# Altium schematic sheet 1S锂电池充电_tp4054.SchDoc
size A4; SheetNumber: 6; SheetTotal: 7
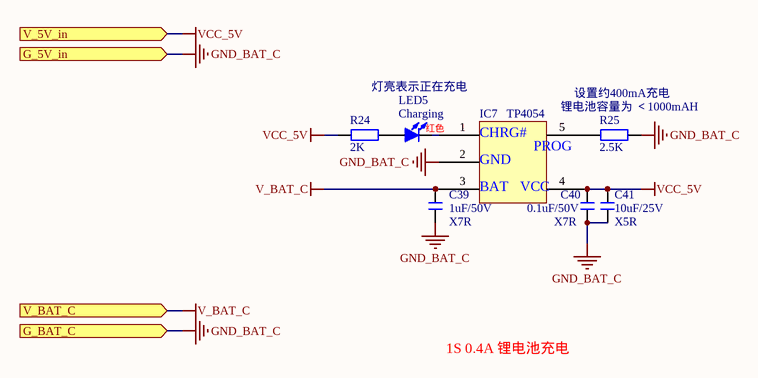
[diagram p0: 1S锂电池充电_tp4054.SchDoc]

## Parts
C39  1uF/50V  BOM名称: X7R  [C 0603_L]
C40  0.1uF/50V  BOM名称: X7R  [C 0402_L]
C41  10uF/25V  BOM名称: X5R  [C 0603_L]
IC7  TP4054  [SOT23-5N]
LED5  Charging  [LED 0805R]
R24  2K  [R 0402_L]
R25  2.5K  [R 0402_L]

## Ports
G_5V_in (in), G_BAT_C (in), V_5V_in (in), V_BAT_C (in)

## Nets
GND_BAT_C: C39.1 C40.2 C41.1 IC7.2 R25.2 ; port G_5V_in, port G_BAT_C
V_BAT_C: C39.2 IC7.3 ; port V_BAT_C
VCC_5V: C40.1 C41.2 IC7.4 R24.2 ; port V_5V_in
NetIC7_1: IC7.1 LED5.2(K)
NetIC7_5: IC7.5 R25.1
NetLED5_1: LED5.1(A) R24.1

## Notes on the sheet
- 灯亮表示正在充电
- 锂电池容量为 ＜1000mAH
- 设置约400mA充电
- (near LED5) 红色
- (near IC7) CHRG#
- (near IC7) GND
- (near IC7) BAT
- (near IC7) VCC
- (near IC7) PROG
- 1S 0.4A 锂电池充电
- Title
- Start date:
- Revision:
- Sheet
- Last date:
- of
- Organization:
- Drawn by:
- Checked by:
- Size:
- A4

## Library data of the parts
C39 C40 = C X7R: 无极性贴片电容 X7R
C41 = C X5R: 无极性贴片电容 X5R
IC7 = 5: 1S锂电充电; BOM名称: 1S锂电充电
LED5 = LED-SMD: 红色 贴片LED; 版权归属: 源创客; BOM名称: 红色 贴片LED; 学习资源: www.ooocke.com
R24 R25 = R: 贴片电阻 E-96 1%; BOM名称: E-96 1%